# EAGLE design PowerReceiver (EAGLE 7.5.0)
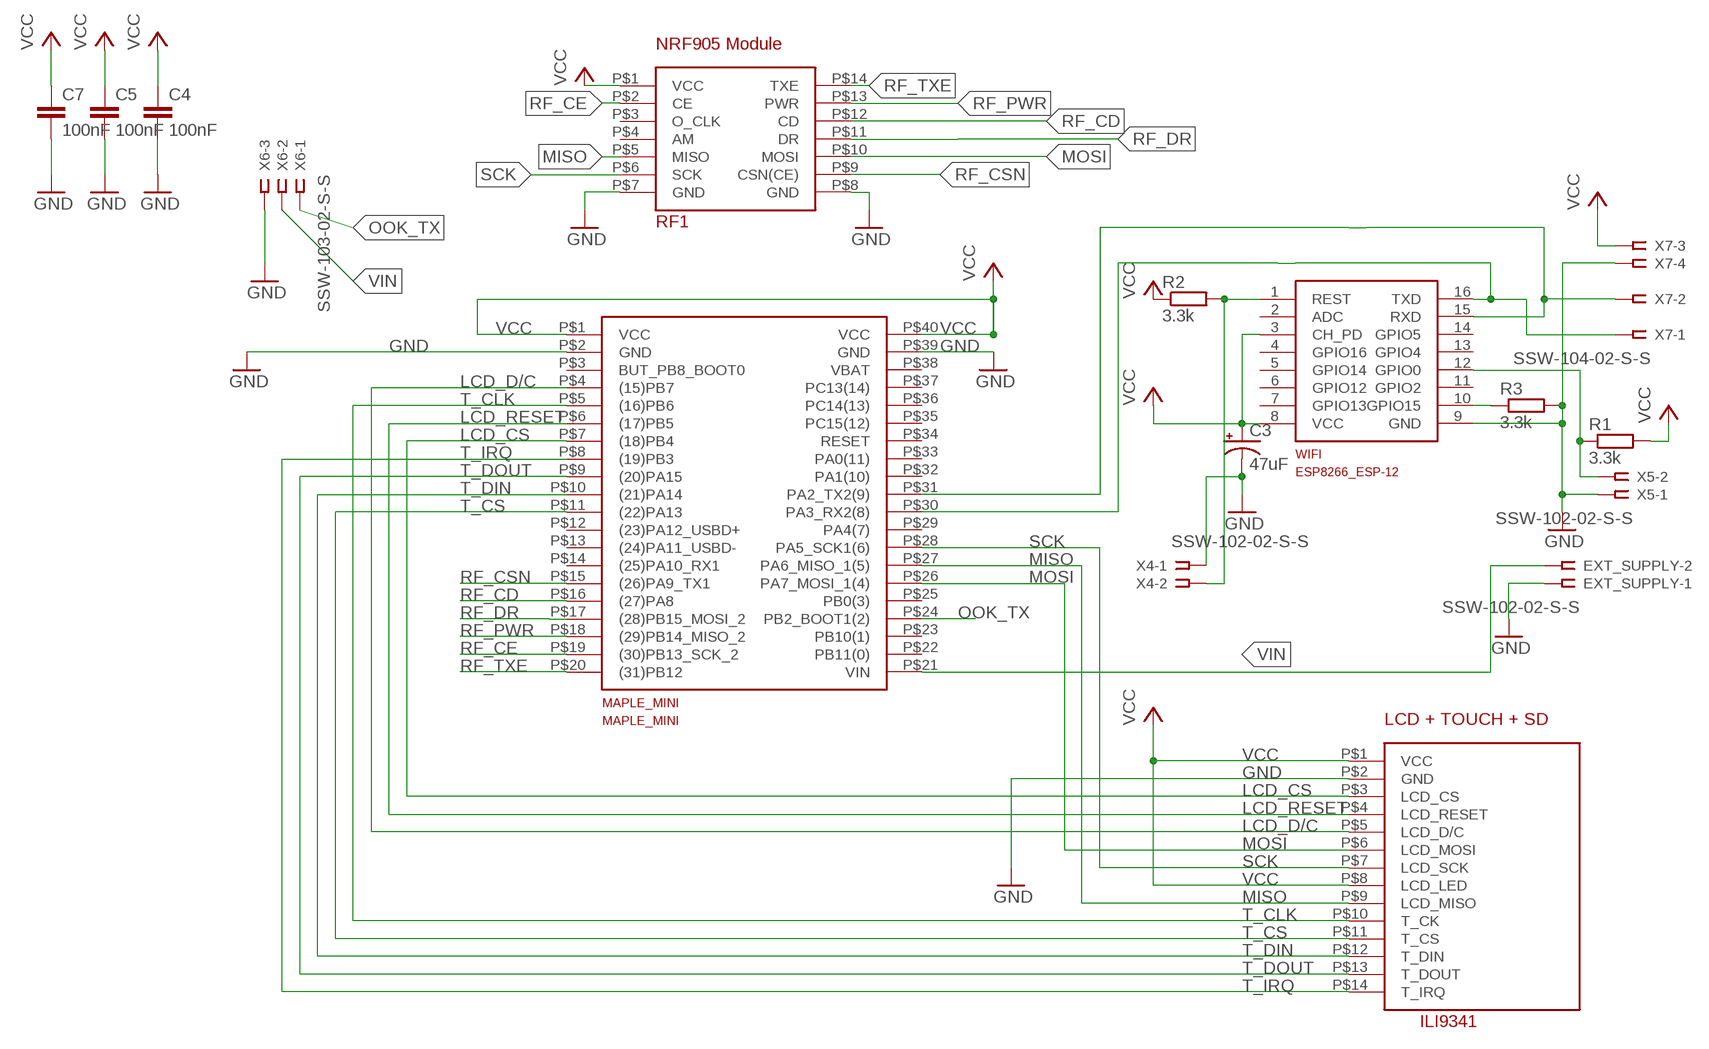
[diagram p0: schematic, sheet 1]

## Parts
C3  47uF  CPOL-USE5-8.5  [E5-8,5]
C4  100nF  C-EU050-035X075  [C050-035X075]
C5  100nF  C-EU050-035X075  [C050-035X075]
C7  100nF  C-EU050-035X075  [C050-035X075]
EXT_SUPPLY  SSW-102-02-S-S  [SSW-102-02-S-S]
ILI9341  ILI9341_TOUCH_SD  [2.4_INCH]
MAPLE_MINI  MAPLE_MINI  [MAPLE_MINI]
R1  3.3k  R-EU_0309/V  [0309V]
R2  3.3k  R-EU_0309/V  [0309V]
R3  3.3k  R-EU_0309/V  [0309V]
RF1  NRF905_MODULE  [PIN14]
WIFI  ESP8266-12  ESP8266-12GPIO04/05_CORRECTED  [ESP8266-ESP12]
X4  SSW-102-02-S-S  [SSW-102-02-S-S]
X5  SSW-102-02-S-S  [SSW-102-02-S-S]
X6  SSW-103-02-S-S  [SSW-103-02-S-S]
X7  SSW-104-02-S-S  [SSW-104-02-S-S]

## Nets
GND: C3.- C4.2 C5.2 C7.2 EXT_SUPPLY.1 ILI9341.P$2(GND) MAPLE_MINI.P$2(GND) MAPLE_MINI.P$39(GND) R3.2 RF1.P$7(GND) RF1.P$8(GND) WIFI.9(GND) X4.1 X5.1 X6.3 X7.4
LCD_CS: ILI9341.P$3(LCD_CS) MAPLE_MINI.P$7((18)PB4)
LCD_D/C: ILI9341.P$5(LCD_D/C) MAPLE_MINI.P$4((15)PB7)
LCD_RESET: ILI9341.P$4(LCD_RESET) MAPLE_MINI.P$6((17)PB5)
MISO: ILI9341.P$9(LCD_MISO) MAPLE_MINI.P$27(PA6_MISO_1(5)) RF1.P$5(MISO)
MOSI: ILI9341.P$6(LCD_MOSI) MAPLE_MINI.P$26(PA7_MOSI_1(4)) RF1.P$10(MOSI)
N$1: R3.1 WIFI.10(GPIO15)
N$2: MAPLE_MINI.P$30(PA3_RX2(8)) WIFI.16(TXD) X7.1
N$3: MAPLE_MINI.P$31(PA2_TX2(9)) WIFI.15(RXD) X7.2
N$11: R2.2 WIFI.1(REST) X4.2
N$13: R1.1 WIFI.12(GPIO0) X5.2
OOK_TX: MAPLE_MINI.P$24(PB2_BOOT1(2)) X6.1
RF_CD: MAPLE_MINI.P$16((27)PA8) RF1.P$12(CD)
RF_CE: MAPLE_MINI.P$19((30)PB13_SCK_2) RF1.P$2(CE)
RF_CSN: MAPLE_MINI.P$15((26)PA9_TX1) RF1.P$9(CSN(CE))
RF_DR: MAPLE_MINI.P$17((28)PB15_MOSI_2) RF1.P$11(DR)
RF_PWR: MAPLE_MINI.P$18((29)PB14_MISO_2) RF1.P$13(PWR)
RF_TXE: MAPLE_MINI.P$20((31)PB12) RF1.P$14(TXE)
SCK: ILI9341.P$7(LCD_SCK) MAPLE_MINI.P$28(PA5_SCK1(6)) RF1.P$6(SCK)
T_CLK: ILI9341.P$10(T_CK) MAPLE_MINI.P$5((16)PB6)
T_CS: ILI9341.P$11(T_CS) MAPLE_MINI.P$11((22)PA13)
T_DIN: ILI9341.P$12(T_DIN) MAPLE_MINI.P$10((21)PA14)
T_DOUT: ILI9341.P$13(T_DOUT) MAPLE_MINI.P$9((20)PA15)
T_IRQ: ILI9341.P$14(T_IRQ) MAPLE_MINI.P$8((19)PB3)
VCC: C3.+ C4.1 C5.1 C7.1 ILI9341.P$1(VCC) ILI9341.P$8(LCD_LED) MAPLE_MINI.P$1(VCC) MAPLE_MINI.P$40(VCC) R1.2 R2.1 RF1.P$1(VCC) WIFI.3(CH_PD) WIFI.8(VCC) X7.3
VIN: EXT_SUPPLY.2 MAPLE_MINI.P$21(VIN) X6.2
Unconnected: MAPLE_MINI.P$3(BUT_PB8_BOOT0) MAPLE_MINI.P$12((23)PA12_USBD+) MAPLE_MINI.P$13((24)PA11_USBD-) MAPLE_MINI.P$14((25)PA10_RX1) MAPLE_MINI.P$22(PB11(0)) MAPLE_MINI.P$23(PB10(1)) MAPLE_MINI.P$25(PB0(3)) MAPLE_MINI.P$29(PA4(7)) MAPLE_MINI.P$32(PA1(10)) MAPLE_MINI.P$33(PA0(11)) MAPLE_MINI.P$34(RESET) MAPLE_MINI.P$35(PC15(12)) MAPLE_MINI.P$36(PC14(13)) MAPLE_MINI.P$37(PC13(14)) MAPLE_MINI.P$38(VBAT) RF1.P$3(O_CLK) RF1.P$4(AM) WIFI.2(ADC) WIFI.4(GPIO16) WIFI.5(GPIO14) WIFI.6(GPIO12) WIFI.7(GPIO13) WIFI.11(GPIO2) WIFI.13(GPIO4) WIFI.14(GPIO5)

## Library data of the parts
C3 = rcl:CPOL-US: POLARIZED CAPACITOR, American symbol
C4 C5 C7 = rcl:C-EU: CAPACITOR, European symbol
EXT_SUPPLY X4 X5 = con-samtec:SSW-102-02-S-S: THROUGH-HOLE .025" SQ POST SOCKET Source: Samtec SSW.pdf; MPN: SSW-102-02-S-S; OC_FARNELL: unknown; OC_NEWARK: 11P9351
ILI9341 = maple_mini:ILI9341_TOUCH_SD: LCD panel with touch screen and SD card socket
MAPLE_MINI = maple_mini:MAPLE_MINI
R1-R3 = resistor:R-EU_: RESISTOR, European symbol
RF1 = maple_mini:NRF905_MODULE
WIFI = maple_mini:ESP8266-12: Espressif ESP8266 ESP-12 Module with GPIO04 and GPIO05 corrected.
X6 = con-samtec:SSW-103-02-S-S: THROUGH-HOLE .025" SQ POST SOCKET Source: Samtec SSW.pdf; MPN: SSW-103-02-S-S; OC_FARNELL: unknown; OC_NEWARK: 11P9367
X7 = con-samtec:SSW-104-02-S-S: THROUGH-HOLE .025" SQ POST SOCKET Source: Samtec SSW.pdf; MPN: SSW-104-02-S-S; OC_FARNELL: unknown; OC_NEWARK: 11P9384

## Net classes
0 default: width 0.013 mm, drill 0.025 mm, clearance 0.006 mm

## Board
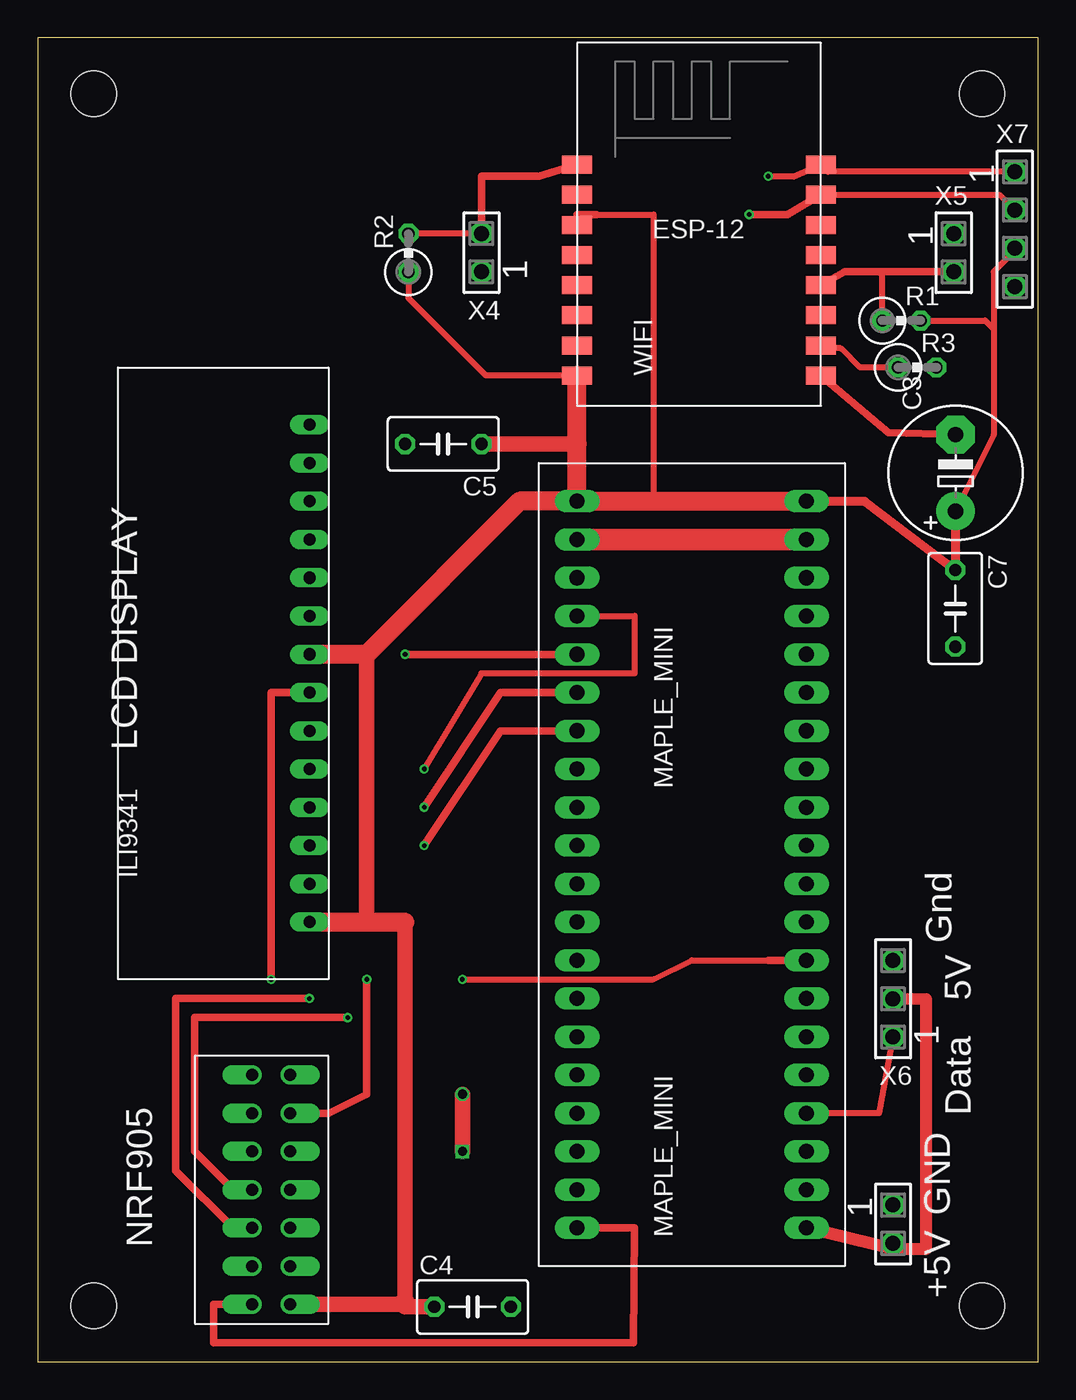
[diagram p1: board, top side]
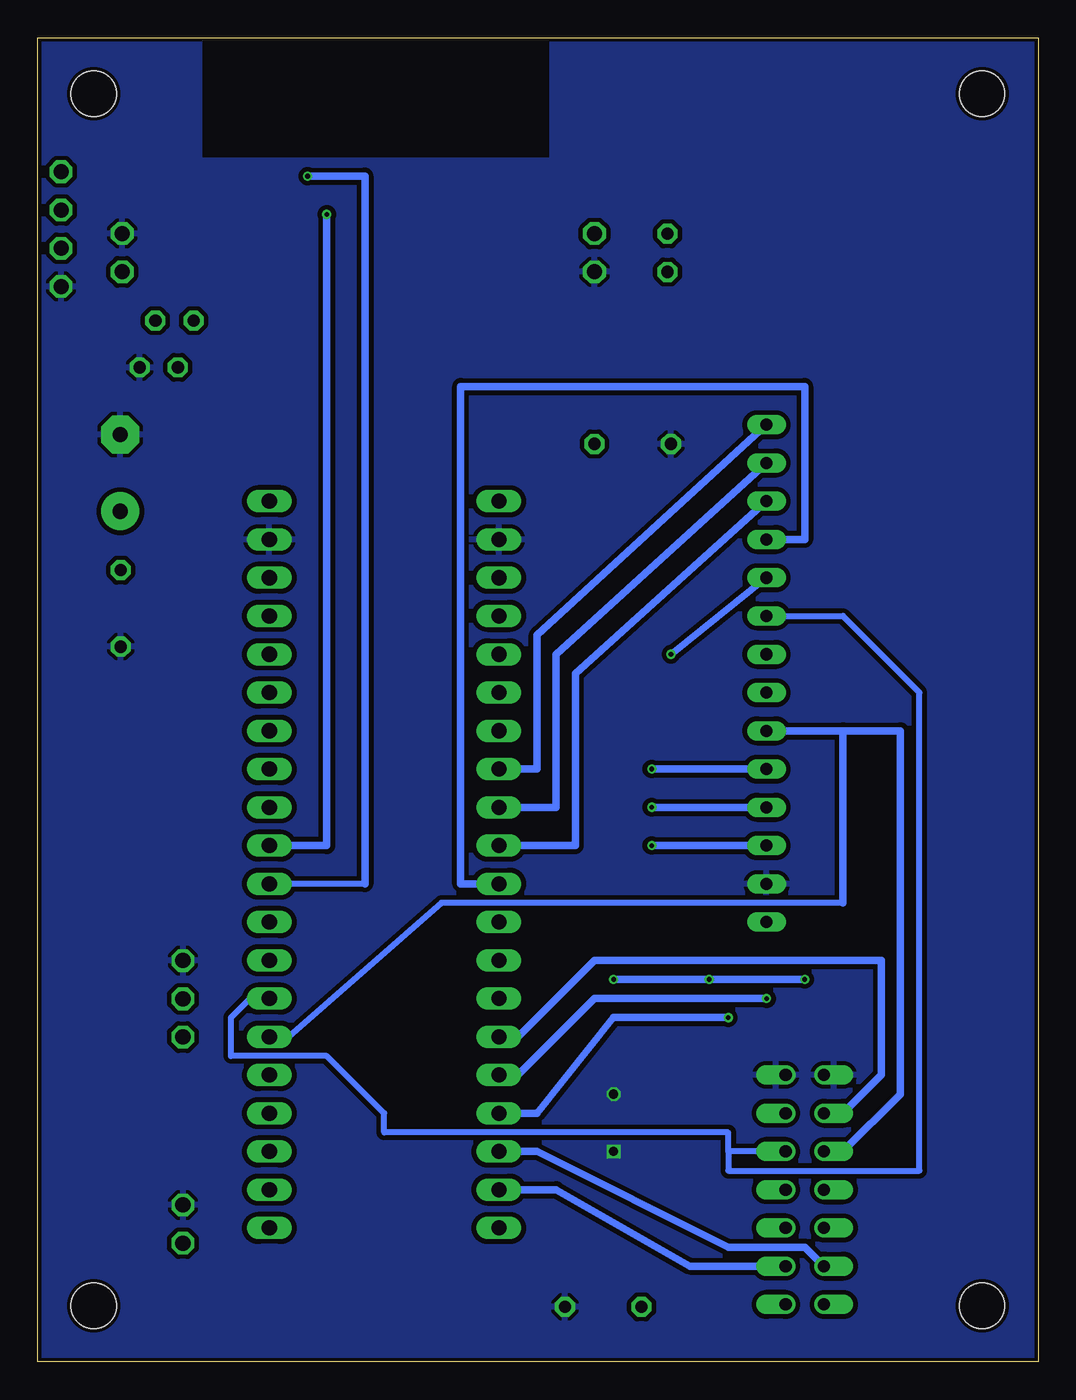
[diagram p2: board, bottom side, seen from below]

Size 66.46 x 87.94 mm. Coordinates in mm from the lower left corner, seen from the top.
Outline: 0,0 66.46,0 66.46,87.94 0,87.94 0,0
Copper layers (1*16): Top 0.035mm / dielectric 1.5mm / Bottom 0.035mm
Design rules "dirt_cheap_dirty_boards.v1 *": minimum track width 5mil, minimum drill 12mil, track to track 12mil, track to pad 12mil, pad to pad 12mil, via to via 12mil, smd to smd 0mil, copper to edge 10mil, drill to drill 10mil, minimum pad ring 10mil, minimum via ring 6mil, stop-mask expansion 2mil, vias tented up to drill 25mil, thermal gap 10mil
Holes 3 mm at 3.73,84.21 62.73,84.21 62.73,3.73 3.73,3.73
bRestrict: area 32.5,80 to 55.5,90.5

### Footprints (pad centres in the part's own frame; a part is rotated, then mirrored left to right if it is on the bottom)
E5-8,5 = drill 1.016 pad 2.54: + -2.54,0 | drill 1.016 pad 2.54 octagon: - 2.54,0
C050-035X075 = drill 0.813 octagon: 1 -2.54,0; 2 2.54,0
SSW-102-02-S-S = drill 1 pad 1.5 octagon: 1 -1.27,0; 2 1.27,0
2.4_INCH = drill 0.8 long: P$1 0,0; P$2 0,-2.54; P$3 0,-5.08; P$4 0,-7.62; P$5 0,-10.16; P$6 0,-12.7; P$7 0,-15.24; P$8 0,-17.78; P$9 0,-20.32; P$10 0,-22.86; P$11 0,-25.4; P$12 0,-27.94; P$13 0,-30.48; P$14 0,-33.02
MAPLE_MINI = drill 1 long: P$1 0,0; P$2 0,-2.54; P$3 0,-5.08; P$4 0,-7.62; P$5 0,-10.16; P$6 0,-12.7; P$7 0,-15.24; P$8 0,-17.78; P$9 0,-20.32; P$10 0,-22.86; P$11 0,-25.4; P$12 0,-27.94; P$13 0,-30.48; P$14 0,-33.02; P$15 0,-35.56; P$16 0,-38.1; P$17 0,-40.64; P$18 0,-43.18; P$19 0,-45.72; P$20 0,-48.26; P$21 15.24,-48.26; P$22 15.24,-45.72; P$23 15.24,-43.18; P$24 15.24,-40.64; P$25 15.24,-38.1; P$26 15.24,-35.56; P$27 15.24,-33.02; P$28 15.24,-30.48; P$29 15.24,-27.94; P$30 15.24,-25.4; P$31 15.24,-22.86; P$32 15.24,-20.32; P$33 15.24,-17.78; P$34 15.24,-15.24; P$35 15.24,-12.7; P$36 15.24,-10.16; P$37 15.24,-7.62; P$38 15.24,-5.08; P$39 15.24,-2.54; P$40 15.24,0
0309V = drill 0.813 octagon: 1 -1.27,0; 2 1.27,0
PIN14 = drill 0.8 offset: P$1 0,0; P$2 0,-2.54; P$3 0,-5.08; P$4 0,-7.62; P$5 0,-10.16; P$6 0,-12.7; P$7 0,-15.24; P$8 2.54,-15.24; P$9 2.54,-12.7; P$10 2.54,-10.16; P$11 2.54,-7.62; P$12 2.54,-5.08; P$13 2.54,-2.54; P$14 2.54,0
ESP8266-ESP12 = smd 2 x 1.2: 1 0,16; 2 0,14; 3 0,12; 4 0,10; 5 0,8; 6 0,6; 7 0,4; 8 0,2; 9 16.2,2; 10 16.2,4; 11 16.2,6; 12 16.2,8; 13 16.2,10; 14 16.2,12; 15 16.2,14; 16 16.2,16
SSW-103-02-S-S = drill 1 pad 1.5 octagon: 1 -2.54,0; 2 0,0; 3 2.54,0
SSW-104-02-S-S = drill 1 pad 1.5 octagon: 1 -3.81,0; 2 -1.27,0; 3 1.27,0; 4 3.81,0

### Placement (x,y rotation side)
C3  60.97,59.03 90 top
C4  28.89,3.65 0 top
C5  26.94,60.96 180 top
C7  60.94,50.04 270 top
EXT_SUPPLY  56.81,9.15 270 top
ILI9341  18.05,29.21 180 top
MAPLE_MINI  35.83,57.15 0 top
R1  57.37,69.15 0 top
R2  24.63,73.65 90 top
R3  58.42,66.04 0 top
RF1  16.78,3.81 180 top
WIFI  35.83,63.5 0 top
X4  29.48,73.66 90 top
X5  60.84,73.66 270 top
X6  56.81,24.11 90 top
X7  64.9,75.22 270 top

### Tracks (layer width: path | path; a pad name or v marks a point on that pad's centre or on a via)
GND  (via drill 0.6)
  Top 0.508: C3.- 56.49,61.7 WIFI.9
  Top 1.016: v28.21,13.97 v28.21,17.78
  Top 1.422: MAPLE_MINI.P$2 MAPLE_MINI.P$39
  Bottom 0.508: MAPLE_MINI.P$39 51.07,54.66
  pour Bottom: -1.27,88.9 17.29,88.9 18.33,89.01 18.84,89.01 27.42,88.9 68.06,88.9 68.06,-2.54 -1.27,-2.54
LCD_CS  (via drill 0.3)
  Top 0.508: v25.67,34.29 30.75,41.91 MAPLE_MINI.P$7
  Bottom 0.508: v25.67,34.29 ILI9341.P$3
LCD_D/C  (via drill 0.3)
  Top 0.406: v25.67,39.37 29.48,45.72 39.64,45.72 39.64,49.53 MAPLE_MINI.P$4
  Bottom 0.508: v25.67,39.37 ILI9341.P$5
LCD_RESET  (via drill 0.3)
  Top 0.508: v25.67,36.83 30.75,44.45 MAPLE_MINI.P$6
  Bottom 0.508: v25.67,36.83 ILI9341.P$4
MISO
  Bottom 0.406: RF1.P$5 20.59,13.97 | MAPLE_MINI.P$27 52.34,24.13 53.61,22.86 53.61,20.32 47.26,20.32 43.45,16.51 43.45,15.24 20.59,15.24 20.59,13.97 | 20.59,13.97 20.59,12.7 7.89,12.7 7.89,44.45 12.97,49.53 ILI9341.P$9
MOSI
  Bottom 0.406: 49.8,21.59 39.64,30.48 12.97,30.48
  Bottom 0.508: RF1.P$10 12.97,13.97 9.16,17.78 9.16,41.91 12.97,41.91 | ILI9341.P$6 12.97,41.91 | 49.8,21.59 MAPLE_MINI.P$26 | 12.97,41.91 12.97,30.48
N$1
  Top 0.406: R3.1 54.61,66.04 53.34,67.31 52.22,67.31 WIFI.10
N$2  (via drill 0.3)
  Top 0.406: v48.53,78.74 48.53,78.71 50.17,78.71 WIFI.16 52.5,79.03 X7.1
  Bottom 0.406: 44.72,31.75 MAPLE_MINI.P$30
  Bottom 0.508: 44.72,31.75 44.72,78.74 v48.53,78.74
N$3  (via drill 0.3)
  Top 0.406: WIFI.15 63.9,77.5 X7.2
  Top 0.508: v47.26,76.2 49.8,76.2 WIFI.15
  Bottom 0.508: MAPLE_MINI.P$31 47.26,34.29 v47.26,76.2
N$11
  Top 0.406: X4.2 R2.2
  Top 0.508: X4.2 29.48,78.74 33.29,78.74 WIFI.1
N$13
  Top 0.406: R1.1 56.1,72.17 55.88,72.39
  Top 0.508: X5.2 55.88,72.39 53.61,72.39 WIFI.12
OOK_TX
  Top 0.127: 51.25,16.62 MAPLE_MINI.P$24
  Top 0.406: X6.1 55.88,16.51 MAPLE_MINI.P$24
RF_CD  (via drill 0.3)
  Top 0.508: RF1.P$12 12.97,8.89 9.16,12.7 9.16,24.13 v18.05,24.13
  Bottom 0.508: v18.05,24.13 29.48,24.13 34.56,19.05 MAPLE_MINI.P$16
RF_CE
  Bottom 0.508: RF1.P$2 23.13,6.35 32.02,11.43 MAPLE_MINI.P$19
RF_CSN
  Bottom 0.508: RF1.P$9 12.97,16.51 10.43,19.05 10.43,26.67 29.48,26.67 34.56,21.59 MAPLE_MINI.P$15
RF_DR  (via drill 0.3)
  Top 0.508: RF1.P$11 12.97,11.43 10.43,13.97 10.43,22.86 v20.59,22.86
  Bottom 0.508: v20.59,22.86 28.21,22.86 33.29,16.51 MAPLE_MINI.P$17
RF_PWR
  Bottom 0.508: MAPLE_MINI.P$18 33.29,13.97 20.59,7.62 15.51,7.62 RF1.P$13
RF_TXE
  Top 0.508: RF1.P$14 11.7,3.81 11.7,1.27 39.56,1.27 39.64,8.89 MAPLE_MINI.P$20
SCK  (via drill 0.3)
  Top 0.406: 48.53,26.67 43.45,26.67 40.91,25.4 v28.21,25.4
  Top 0.508: RF1.P$6 19.32,16.51 21.86,17.78 v21.86,25.4 | v15.51,25.4 15.51,44.45 ILI9341.P$7 | 48.53,26.67 MAPLE_MINI.P$28
  Bottom 0.508: v15.51,25.4 v21.86,25.4 v28.21,25.4
T_CLK  (via drill 0.3)
  Top 0.508: MAPLE_MINI.P$5 v24.4,46.99
  Bottom 0.508: v24.4,46.99 ILI9341.P$10
T_CS
  Bottom 0.508: ILI9341.P$11 15.51,54.61 15.51,64.77 38.37,64.77 38.37,31.75 MAPLE_MINI.P$11
T_DIN
  Bottom 0.508: ILI9341.P$12 30.75,45.72 30.75,34.29 MAPLE_MINI.P$10
T_DOUT
  Bottom 0.508: ILI9341.P$13 32.02,46.99 32.02,36.83 MAPLE_MINI.P$9
T_IRQ
  Bottom 0.508: ILI9341.P$14 33.29,48.26 33.29,39.37 MAPLE_MINI.P$8
VCC
  Top 0.406: 37.1,76.2 40.91,76.2 40.91,57.15 | R2.1 24.62,70.65 29.76,65.52 35.81,65.52 WIFI.8 | X7.3 64.9,73.79 63.5,72.39 63.5,68.58 | 63.5,68.58 63.5,61.56 C3.+ | R1.2 62.93,69.15 63.5,68.58
  Top 0.508: 18.05,3.81 RF1.P$1 | MAPLE_MINI.P$1 34.56,57.15 | 37.1,76.2 35.83,76.2 WIFI.3
  Top 0.61: MAPLE_MINI.P$40 54.92,57.15 C7.1 60.97,52.51 C3.+ | 24.4,3.65 24.4,4
  Top 1.016: 24.4,3.81 18.05,3.81 | 24.4,29.21 24.4,4 | 21.86,29.21 21.86,46.99 | C5.1 35.83,60.96 | C4.1 24.4,3.65
  Top 1.27: 24.4,4 24.4,3.81 | ILI9341.P$1 21.86,29.21 24.4,29.21 | MAPLE_MINI.P$1 35.83,60.96 WIFI.8 | MAPLE_MINI.P$1 40.91,57.15 MAPLE_MINI.P$40 | MAPLE_MINI.P$1 32.02,57.15 21.86,46.99 ILI9341.P$8
VIN
  Top 0.813: 56.77,7.5 MAPLE_MINI.P$21 | EXT_SUPPLY.2 56.77,7.5 | 56.77,7.5 59,7.5 59,24.08 X6.2

### Text on the board
tPlace: LCD DISPLAY | Gnd | 5V | Data | GND | NRF905 | +5V